# EAGLE design hardware (EAGLE 7.1.0)
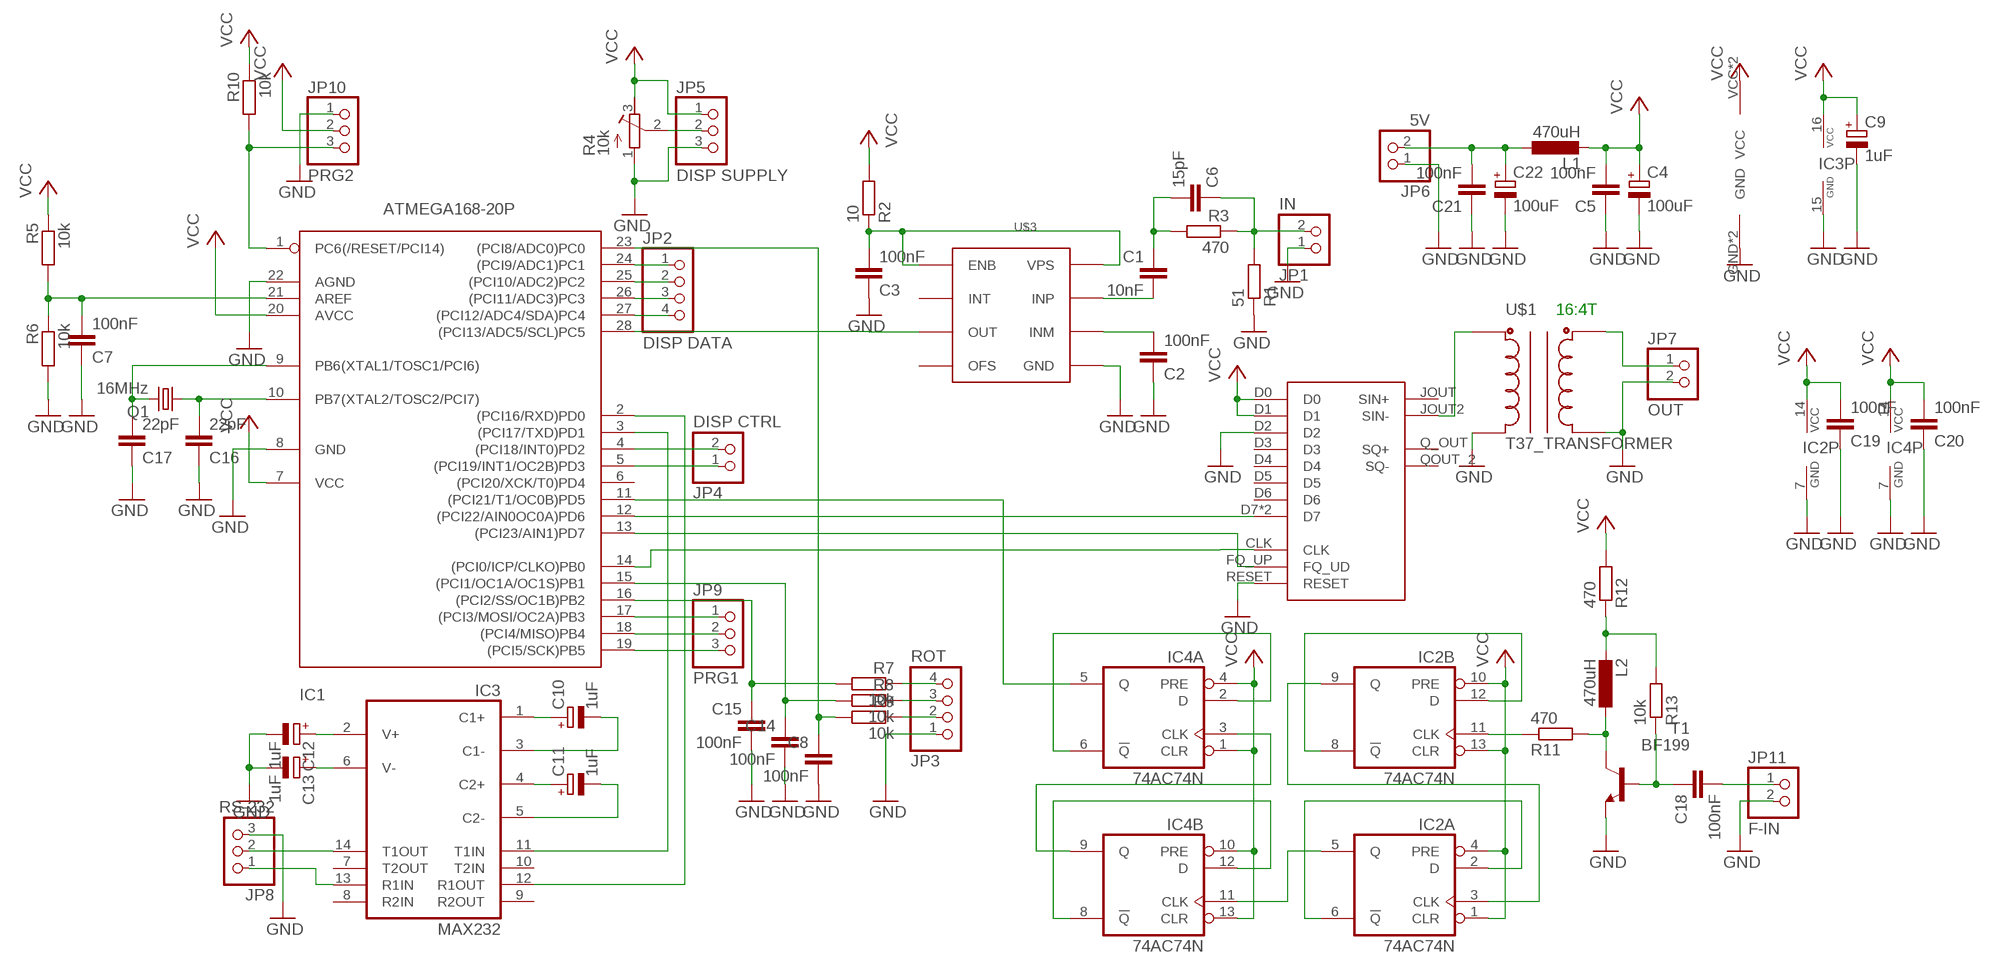
[diagram p0: schematic, sheet 1]

## Parts
C1  10nF  C-EU025-025X050  [C025-025X050]
C2  100nF  C-EU025-025X050  [C025-025X050]
C3  100nF  C-EU025-025X050  [C025-025X050]
C4  100uF  CPOL-EUE2.5-6  [E2,5-6]
C5  100nF  C-EU025-025X050  [C025-025X050]
C6  15pF  C-EU025-025X050  [C025-025X050]
C7  100nF  C-EU025-025X050  [C025-025X050]
C8  100nF  C-EU025-025X050  [C025-025X050]
C9  1uF  CPOL-EUE2.5-6  [E2,5-6]
C10  1uF  CPOL-EUE5-5  [E5-5]
C11  1uF  CPOL-EUE2.5-5  [E2,5-5]
C12  1uF  CPOL-EUE2.5-6  [E2,5-6]
C13  1uF  CPOL-EUE2.5-6  [E2,5-6]
C14  100nF  C-EU050-025X075  [C050-025X075]
C15  100nF  C-EU050-025X075  [C050-025X075]
C16  22pF  C-EU050-025X075  [C050-025X075]
C17  22pF  C-EU050-025X075  [C050-025X075]
C18  100nF  C-EU075-032X103  [C075-032X103]
C19  100nF  C-EU025-025X050  [C025-025X050]
C20  100nF  C-EU025-025X050  [C025-025X050]
C21  100nF  C-EU025-025X050  [C025-025X050]
C22  100uF  CPOL-EUE2.5-6  [E2,5-6]
IC1  ATMEGA168-20P  [DIL28-3]
IC2  74AC74N  [DIL14]
IC3  MAX232  [DIL16]
IC4  74AC74N  [DIL14]
JP1  IN  PINHD-1X2  [1X02]
JP2  DISP DATA  PINHD-1X4  [1X04]
JP3  ROT  PINHD-1X4  [1X04]
JP4  DISP CTRL  PINHD-1X2  [1X02]
JP5  DISP SUPPLY  PINHD-1X3  [1X03]
JP6  5V  PINHD-1X2  [1X02]
JP7  OUT  PINHD-1X2  [1X02]
JP8  RS-232  PINHD-1X3  [1X03]
JP9  PRG1  PINHD-1X3  [1X03]
JP10  PRG2  PINHD-1X3  [1X03]
JP11  F-IN  PINHD-1X2  [1X02]
L1  470uH  L-EU0204/7  [0204/7]
L2  470uH  L-EU0204/7  [0204/7]
Q1  16MHz  CRYSTALHC49S  [HC49/S]
R1  51  R-EU_0204/2V  [0204V]
R2  10  R-EU_0207/10  [0207/10]
R3  470  R-EU_0204/2V  [0204V]
R4  10k  R-TRIMM3339P  [RTRIM3339P]
R5  10k  R-EU_0204/2V  [0204V]
R6  10k  R-EU_0204/2V  [0204V]
R7  10k  R-EU_0204/5  [0204/5]
R8  10k  R-EU_0204/2V  [0204V]
R9  10k  R-EU_0207/10  [0207/10]
R10  10k  R-EU_0207/15  [0207/15]
R11  470  R-EU_0207/10  [0207/10]
R12  470  R-EU_0204/7  [0204/7]
R13  10k  R-EU_0204/2V  [0204V]
T1  BF199  BF494-NPN-TO92-CEB  [TO92-CEB]
U$1  T37_TRANSFORMER  [T37_TRANSFORMER]
U$2  DDS-1  [DDS-1]
U$3  AD8307  [DIL08]

## Nets
GND: C2.1 C3.1 C4.- C5.1 C7.1 C8.2 C9.- C12.- C13.- C14.2 C15.2 C16.1 C17.1 C19.1 C20.1 C21.1 C22.- IC1.8(GND) IC1.22(AGND) IC2.7(P:GND) IC3.15(GND) IC4.7(P:GND) JP1.1 JP3.1 JP5.3 JP6.1 JP7.2 JP8.3 JP10.1 JP11.2 R1.1 R4.1(A) R6.2 T1.E U$1.C1A U$1.C2A U$2.D2 U$2.GND U$2.GND2(GND) U$2.RESET U$3.2(GND)
N$1: IC1.17((PCI3/MOSI/OC2A)PB3) JP9.1
N$2: C6.1 JP1.2 R1.2 R3.1
N$3: C1.2 U$3.8(INP)
N$4: C2.2 U$3.1(INM)
N$5: IC1.18((PCI4/MISO)PB4) JP9.2
N$6: IC1.19((PCI5/SCK)PB5) JP9.3
N$7: IC1.1(PC6(/RESET/PCI14)) JP10.3 R10.2
N$8: C3.2 R2.1 U$3.6(ENB) U$3.7(VPS)
N$9: IC1.28((PCI13/ADC5/SCL)PC5) U$3.4(OUT)
N$10: C21.2 C22.+ JP6.2 L1.1
N$11: IC3.14(T1OUT) JP8.2
N$12: C1.1 C6.2 R3.2
N$13: U$1.C1B U$2.JOUT2(SIN-)
N$14: JP7.1 U$1.C2B
N$15: IC1.13((PCI23/AIN1)PD7) U$2.FQ_UP(FQ_UD)
N$16: IC1.27((PCI12/ADC4/SDA)PC4) JP2.4
N$17: IC1.3((PCI17/TXD)PD1) IC3.11(T1IN)
N$18: IC1.26((PCI11/ADC3)PC3) JP2.3
N$19: IC1.25((PCI10/ADC2)PC2) JP2.2
N$20: IC1.24((PCI9/ADC1)PC1) JP2.1
N$21: C15.1 IC1.16((PCI2/SS/OC1B)PB2) R7.2
N$22: IC1.2((PCI16/RXD)PD0) IC3.12(R1OUT)
N$23: C14.1 IC1.15((PCI1/OC1A/OC1S)PB1) R8.2
N$24: JP3.4 R7.1
N$25: IC1.4((PCI18/INT0)PD2) JP4.2
N$26: IC1.14((PCI0/ICP/CLKO)PB0) U$2.CLK
N$27: IC1.5((PCI19/INT1/OC2B)PD3) JP4.1
N$28: JP5.2 R4.2(S)
N$29: C7.2 IC1.21(AREF) R5.2 R6.1
N$30: IC1.12((PCI22/AIN0OC0A)PD6) U$2.D7 U$2.D7_2(D7)
N$31: JP3.3 R8.1
N$32: JP3.2 R9.1
N$33: C8.1 IC1.23((PCI8/ADC0)PC0) R9.2
N$34: IC3.13(R1IN) JP8.1
N$35: C12.+ IC3.2(V+)
N$36: C13.+ IC3.6(V-)
N$37: C16.2 IC1.10(PB7(XTAL2/TOSC2/PCI7)) Q1.1
N$38: C10.+ IC3.1(C1+)
N$39: C10.- IC3.3(C1-)
N$40: C11.+ IC3.4(C2+)
N$41: C11.- IC3.5(C2-)
N$42: C17.2 IC1.9(PB6(XTAL1/TOSC1/PCI6)) Q1.2
N$45: IC4.2(A:D) IC4.6(A:!Q)
N$46: IC1.11((PCI21/T1/OC0B)PD5) IC4.5(A:Q)
N$47: IC2.8(B:!Q) IC2.12(B:D)
N$48: IC2.2(A:D) IC2.6(A:!Q)
N$49: IC4.8(B:!Q) IC4.12(B:D)
N$50: IC2.3(A:CLK) IC2.9(B:Q)
N$51: IC2.5(A:Q) IC4.11(B:CLK)
N$52: IC4.3(A:CLK) IC4.9(B:Q)
N$53: IC2.11(B:CLK) R11.1
N$54: L2.1 R11.2 T1.C
N$55: L2.2 R12.1 R13.2
N$56: C18.1 R13.1 T1.B
N$57: C18.2 JP11.1
VCC: C4.+ C5.2 C9.+ C19.2 C20.2 IC1.7(VCC) IC1.20(AVCC) IC2.1(A:CLR) IC2.4(A:PRE) IC2.10(B:PRE) IC2.13(B:CLR) IC2.14(P:VCC) IC3.16(VCC) IC4.1(A:CLR) IC4.4(A:PRE) IC4.10(B:PRE) IC4.13(B:CLR) IC4.14(P:VCC) JP5.1 JP10.2 L1.2 R2.2 R4.3(E) R5.1 R10.1 R12.2 U$2.D0 U$2.D1 U$2.VCC U$2.VCC2(VCC)
Unconnected: IC1.6((PCI20/XCK/T0)PD4) IC3.7(T2OUT) IC3.8(R2IN) IC3.9(R2OUT) IC3.10(T2IN) U$2.D3 U$2.D4 U$2.D5 U$2.D6 U$2.JOUT(SIN+) U$2.Q_OUT(SQ+) U$2.QOUT_2(SQ-) U$3.3(OFS) U$3.5(INT)

## Notes on the sheet
- 16:4T

## Library data of the parts
C1-C3 C5-C8 C14-C21 = rcl:C-EU: CAPACITOR, European symbol
C4 C9-C13 C22 = rcl:CPOL-EU: POLARIZED CAPACITOR, European symbol
IC1 = adafruit:ATMEGA168*P: MICROCONTROLLER 16 kBytes FLASH 1 kBytes SRAM 512 Bytes EEPROM USART 8-channel 10 bit ADC
IC2 IC4 = 74xx-eu:74*74: Dual D type positive edge triggered FLIP FLOP, preset and clear
IC3 = maxim:MAX232: RS232 TRANSCEIVER; MF: MAXIM; MPN: MAX232ACPE+; OC_FARNELL: 9723773; OC_NEWARK: 68K4544
JP1 JP4 JP6 JP7 JP11 = pinhead:PINHD-1X2: PIN HEADER
JP2 JP3 = pinhead:PINHD-1X4: PIN HEADER
JP5 JP8-JP10 = pinhead:PINHD-1X3: PIN HEADER
L1 L2 = rcl:L-EU: INDUCTOR, European symbol
Q1 = crystal:CRYSTAL: CRYSTAL; OC_FARNELL: 1667008; OC_NEWARK: unknown
R1-R3 R5-R13 = rcl:R-EU_: RESISTOR, European symbol
R4 = rcl:R-TRIMM: Trimm resistor
T1 = transistor-neu-to92:*-NPN-: NPN Transistror
U$1 = toroid:T37_TRANSFORMER: Transformer wound on a T37 Toroid
U$2 = minikits:DDS-1
U$3 = -- Eigene:AD8307

## Board
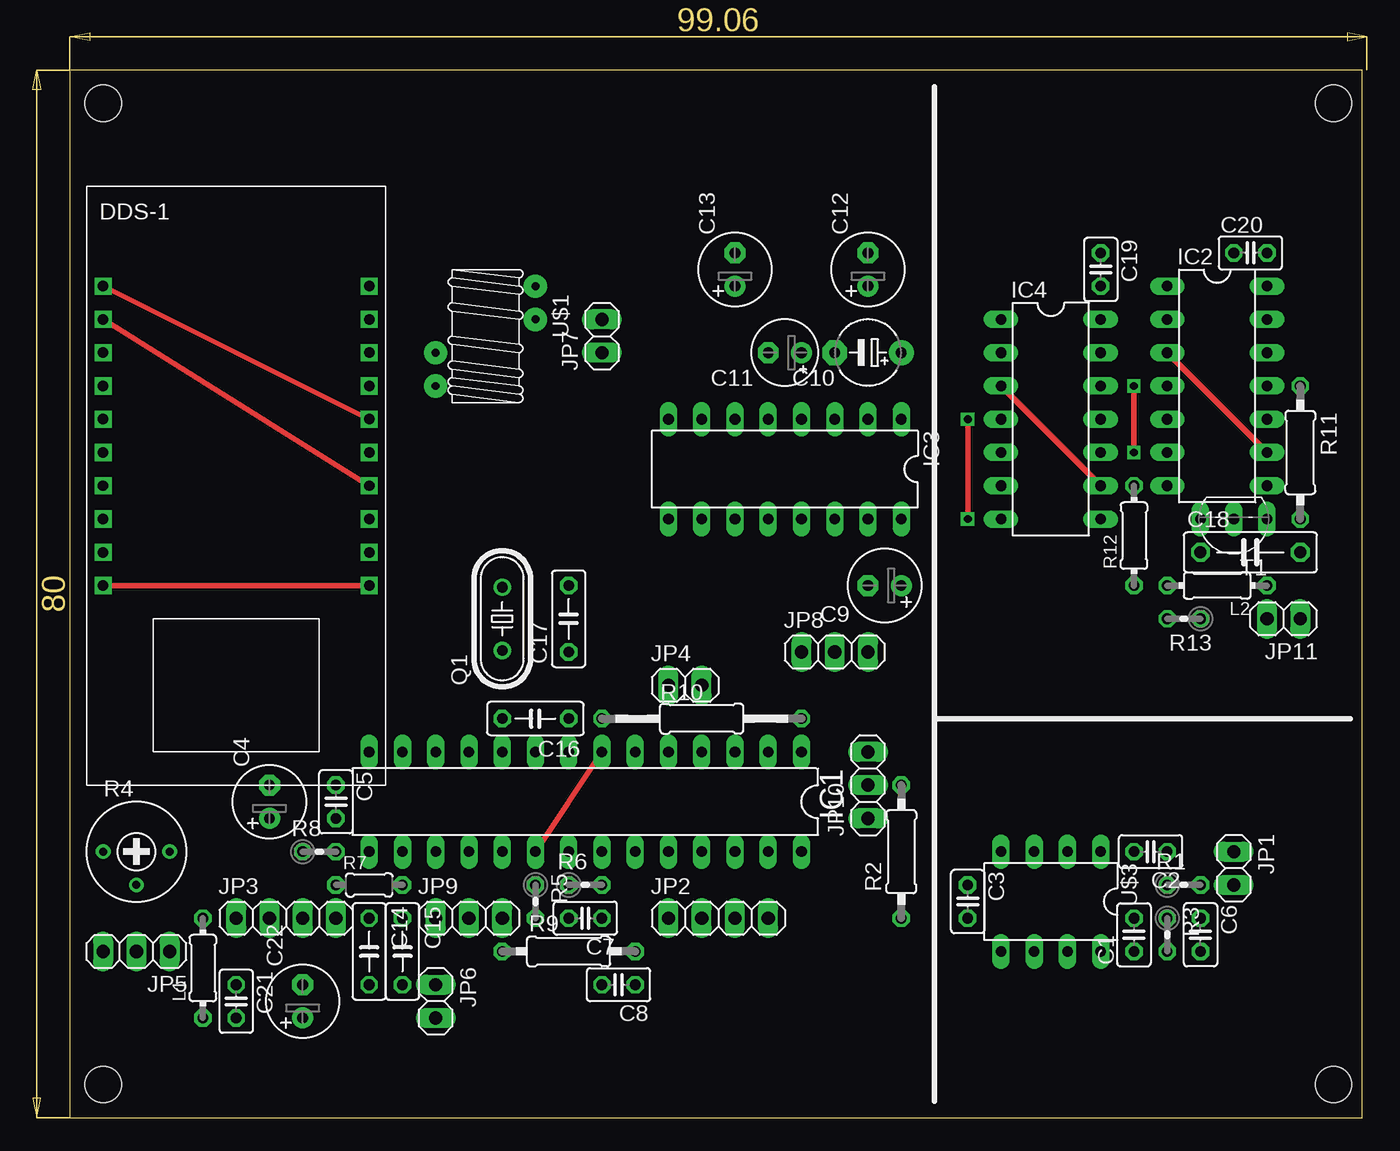
[diagram p1: board, top side]
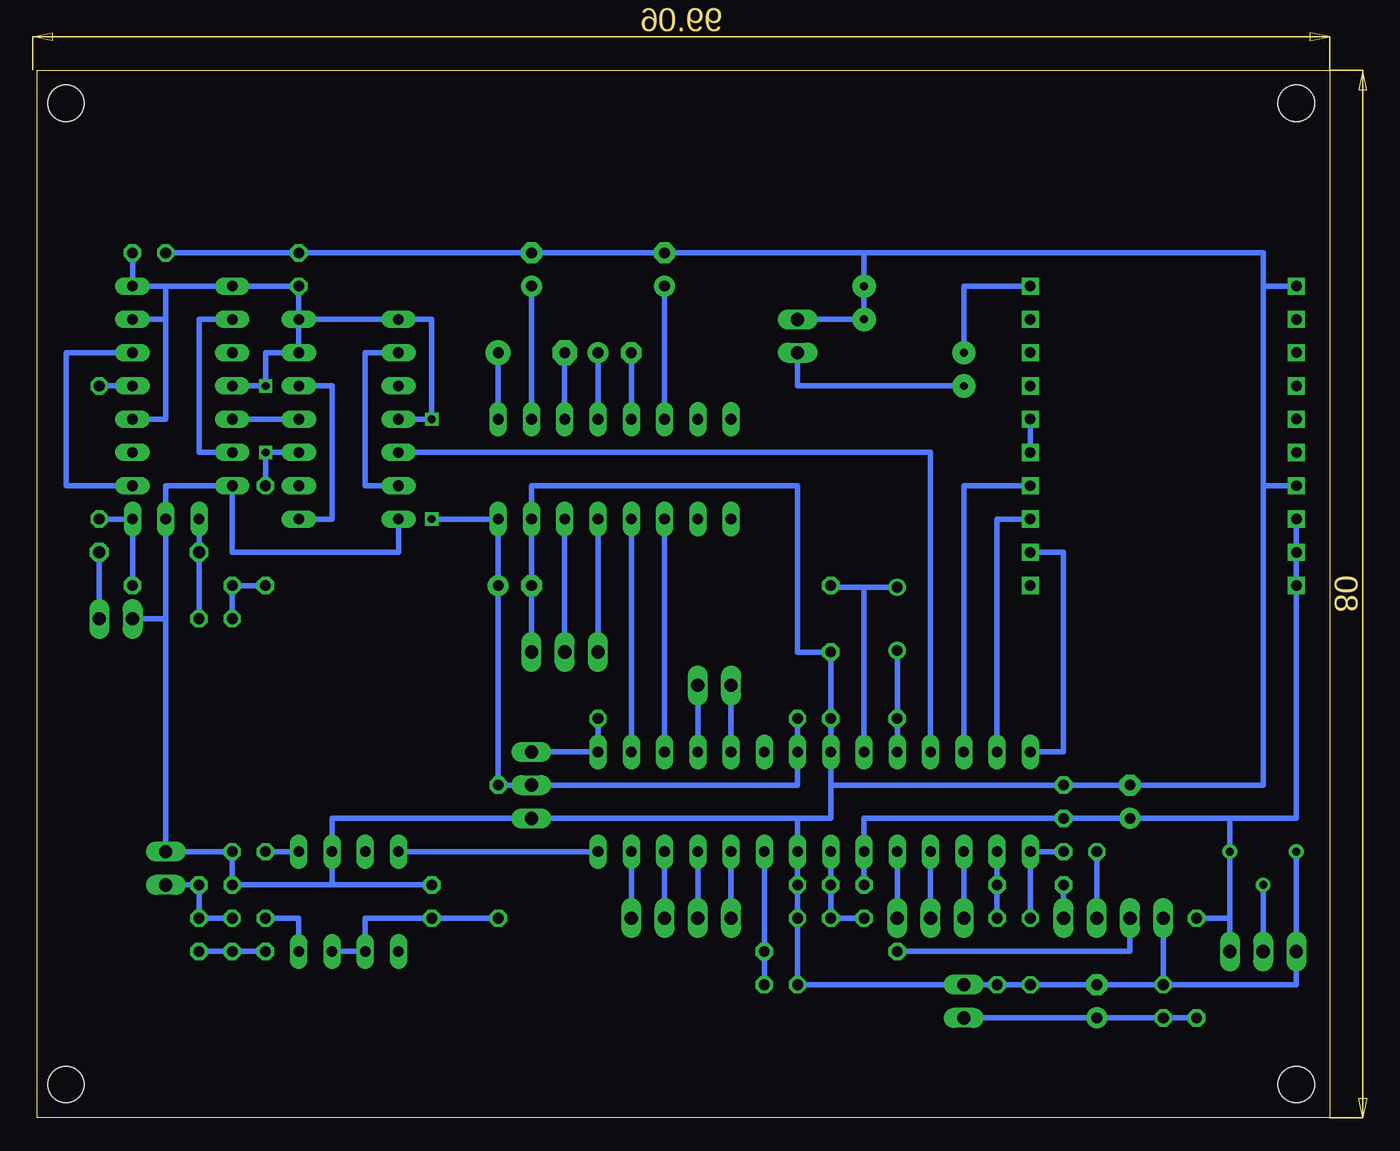
[diagram p2: board, bottom side, seen from below]

Size 98.73 x 80 mm. Coordinates in mm from the lower left corner, seen from the top.
Outline: 0,0 98.73,0 98.73,80 0,80 0,0
Copper layers (1*16): Top 0.035mm / dielectric 1.5mm / Bottom 0.035mm
Design rules "default": minimum track width 10mil, minimum drill 24mil, track to track 8mil, track to pad 8mil, pad to pad 8mil, via to via 8mil, smd to smd 8mil, copper to edge 40mil, drill to drill 8mil, minimum pad ring 10mil, minimum via ring 8mil, stop-mask expansion 4mil, vias tented up to drill 0mil, thermal gap 10mil
Holes 2.8 mm at 2.54,77.47 2.54,2.54 96.52,2.54 96.52,77.47

### Footprints (pad centres in the part's own frame; a part is rotated, then mirrored left to right if it is on the bottom)
C025-025X050 = drill 0.813 octagon: 1 -1.27,0; 2 1.27,0
E2,5-6 = drill 0.813 pad 1.6: + -1.27,0 | drill 0.813 pad 1.6 octagon: - 1.27,0
E5-5 = drill 0.813 pad 1.905: + -2.54,0 | drill 0.813 pad 1.905 octagon: - 2.54,0
E2,5-5 = drill 0.813 pad 1.6: + -1.27,0 | drill 0.813 pad 1.6 octagon: - 1.27,0
C050-025X075 = drill 0.813 octagon: 1 -2.54,0; 2 2.54,0
C075-032X103 = drill 0.914 octagon: 1 -3.81,0; 2 3.81,0
DIL28-3 = drill 0.813 long: 1 -16.51,-3.81; 2 -13.97,-3.81; 3 -11.43,-3.81; 4 -8.89,-3.81; 5 -6.35,-3.81; 6 -3.81,-3.81; 7 -1.27,-3.81; 8 1.27,-3.81; 9 3.81,-3.81; 10 6.35,-3.81; 11 8.89,-3.81; 12 11.43,-3.81; 13 13.97,-3.81; 14 16.51,-3.81; 15 16.51,3.81; 16 13.97,3.81; 17 11.43,3.81; 18 8.89,3.81; 19 6.35,3.81; 20 3.81,3.81; 21 1.27,3.81; 22 -1.27,3.81; 23 -3.81,3.81; 24 -6.35,3.81; 25 -8.89,3.81; 26 -11.43,3.81; 27 -13.97,3.81; 28 -16.51,3.81
DIL14 = drill 0.813 long: 1 -7.62,-3.81; 2 -5.08,-3.81; 3 -2.54,-3.81; 4 0,-3.81; 5 2.54,-3.81; 6 5.08,-3.81; 7 7.62,-3.81; 8 7.62,3.81; 9 5.08,3.81; 10 2.54,3.81; 11 0,3.81; 12 -2.54,3.81; 13 -5.08,3.81; 14 -7.62,3.81
DIL16 = drill 0.813 long: 1 -8.89,-3.81; 2 -6.35,-3.81; 3 -3.81,-3.81; 4 -1.27,-3.81; 5 1.27,-3.81; 6 3.81,-3.81; 7 6.35,-3.81; 8 8.89,-3.81; 9 8.89,3.81; 10 6.35,3.81; 11 3.81,3.81; 12 1.27,3.81; 13 -1.27,3.81; 14 -3.81,3.81; 15 -6.35,3.81; 16 -8.89,3.81
1X02 = drill 1.016 long: 1 -1.27,0; 2 1.27,0
1X04 = drill 1.016 long: 1 -3.81,0; 2 -1.27,0; 3 1.27,0; 4 3.81,0
1X03 = drill 1.016 long: 1 -2.54,0; 2 0,0; 3 2.54,0
0204/7 = drill 0.813 octagon: 1 -3.81,0; 2 3.81,0
HC49/S = drill 0.813: 1 -2.413,0; 2 2.413,0
0204V = drill 0.813 octagon: 1 -1.27,0; 2 1.27,0
0207/10 = drill 0.813 octagon: 1 -5.08,0; 2 5.08,0
RTRIM3339P = drill 0.61: 1 -2.54,0; 2 0,-2.54; 3 2.54,0
0204/5 = drill 0.813 octagon: 1 -2.54,0; 2 2.54,0
0207/15 = drill 0.813 octagon: 1 -7.62,0; 2 7.62,0
TO92-CEB = drill 0.813 long: B 2.54,0; C -2.54,0; E 0,0
T37_TRANSFORMER = drill 0.6 pad 1.778: C1A -3.81,-3.81; C1B 3.81,1.27; C2A -3.81,-1.27; C2B 3.81,3.81
DDS-1 = drill 0.8 square: CLK -11.43,7.62; D0 8.89,7.62; D1 8.89,5.08; D2 8.89,2.54; D3 8.89,0; D4 8.89,-2.54; D5 8.89,-5.08; D6 8.89,-7.62; D7 -11.43,2.54; D7_2 8.89,-10.16; FQ_UP -11.43,5.08; GND -11.43,-2.54; GND2 8.89,-12.7; JOUT -11.43,-10.16; JOUT2 -11.43,-12.7; Q_OUT -11.43,-5.08; QOUT_2 -11.43,-7.62; RESET -11.43,0; VCC -11.43,10.16; VCC2 8.89,10.16
DIL08 = drill 0.813 long: 1 -3.81,-3.81; 2 -1.27,-3.81; 3 1.27,-3.81; 4 3.81,-3.81; 5 3.81,3.81; 6 1.27,3.81; 7 -1.27,3.81; 8 -3.81,3.81

### Placement (x,y rotation side)
C1  81.28,13.97 90 top
C2  82.55,20.32 180 top
C3  68.58,16.51 270 top
C4  15.24,24.13 90 top
C5  20.32,24.13 270 top
C6  86.36,13.97 270 top
C7  39.37,15.24 180 top
C8  41.91,10.16 180 top
C9  62.23,40.64 180 top
C10  60.96,58.42 180 top
C11  54.61,58.42 180 top
C12  60.96,64.77 90 top
C13  50.8,64.77 90 top
C14  22.86,12.7 270 top
C15  25.4,12.7 270 top
C16  35.56,30.48 180 top
C17  38.1,38.1 90 top
C18  90.17,43.18 0 top
C19  78.74,64.77 270 top
C20  90.17,66.04 0 top
C21  12.7,8.89 270 top
C22  17.78,8.89 90 top
IC1  39.37,24.13 180 top
IC2  87.63,55.88 270 top
IC3  54.61,49.53 180 top
IC4  74.93,53.34 270 top
JP1  88.9,19.05 270 top
JP2  49.53,15.24 0 top
JP3  16.51,15.24 0 top
JP4  46.99,33.02 0 top
JP5  5.08,12.7 180 top
JP6  27.94,8.89 270 top
JP7  40.64,59.69 90 top
JP8  58.42,35.56 0 top
JP9  30.48,15.24 0 top
JP10  60.96,25.4 90 top
JP11  92.71,38.1 180 top
L1  10.16,11.43 90 top
L2  87.63,40.64 180 top
Q1  33.02,38.1 90 top
R1  85.09,17.78 0 top
R2  63.5,20.32 90 top
R3  83.82,13.97 270 top
R4  5.08,20.32 0 top
R5  35.56,16.51 270 top
R6  39.37,17.78 0 top
R7  22.86,17.78 0 top
R8  19.05,20.32 0 top
R9  38.1,12.7 0 top
R10  48.26,30.48 0 top
R11  93.98,50.8 270 top
R12  81.28,44.45 90 top
R13  85.09,38.1 180 top
T1  88.9,45.72 180 top
U$1  31.75,59.69 180 top
U$2  11.43,50.8 180 top
U$3  74.93,16.51 180 top

### Tracks (layer width: path | path; a pad name or v marks a point on that pad's centre or on a via)
GND
  Top 0.406: U$2.GND2 U$2.GND
  Bottom 0.406: C3.1 76.2,17.78 | 76.2,17.78 U$3.2 | U$2.RESET U$2.GND | 38.1,25.4 IC1.8 C16.1 38.1,31.75 C17.1 40.64,35.56 40.64,48.26 60.96,48.26 IC3.15 C9.- JP8.3 | 38.1,25.4 38.1,22.86 40.64,22.86 | U$3.2 76.2,17.78 | C13.- C12.- | 76.2,17.78 R1.1 C2.1 JP1.1 88.9,38.1 | 40.64,22.86 IC1.22 R6.2 C7.1 C8.2 JP6.1 | U$3.2 76.2,22.86 71.12,22.86 JP10.1 | U$2.GND2 5.08,63.5 | 5.08,63.5 5.08,48.26 U$2.D2 | 5.08,66.04 33.02,66.04 | 33.02,66.04 C13.- | JP7.2 U$1.C2A U$1.C1A 35.56,66.04 33.02,66.04 | 38.1,25.4 C5.1 C4.- 5.08,25.4 5.08,63.5 | R4.1 JP5.3 2.54,10.16 | C14.2 C15.2 | JP10.1 40.64,22.86 | C15.2 C14.2 | JP10.1 66.04,22.86 | C12.- C13.- | C13.- 33.02,66.04 | 33.02,66.04 5.08,66.04 | 88.9,38.1 T1.E 88.9,48.26 IC2.7 83.82,43.18 71.12,43.18 IC4.7 | JP11.2 88.9,38.1 | 5.08,66.04 5.08,63.5 | C12.- 63.5,66.04 C19.1 C20.1 | R4.1 2.54,10.16 | C15.2 JP6.1 | C15.2 C14.2 | C21.1 C22.- C14.2 | R4.1 2.54,10.16 | JP3.1 C21.1 | 2.54,10.16 C21.1 | JP6.1 C15.2
N$1
  Bottom 0.406: JP9.1 IC1.17
N$2
  Bottom 0.406: R3.1 C6.1 R1.2 JP1.2
N$3
  Bottom 0.406: U$3.8 78.74,15.24 C1.2
N$4
  Bottom 0.406: C2.2 U$3.1
N$5
  Bottom 0.406: JP9.2 IC1.18
N$6
  Bottom 0.406: JP9.3 IC1.19
N$7
  Bottom 0.406: R10.2 IC1.1 JP10.3
N$8
  Bottom 0.406: U$3.7 U$3.6 73.66,15.24 71.12,15.24 | C3.2 71.12,15.24 | C3.2 71.12,15.24 | R2.1 C3.2
N$9
  Bottom 0.406: U$3.4 IC1.28
N$10
  Bottom 0.406: C22.+ 19.05,7.62 | 19.05,7.62 JP6.2 | L1.1 C21.2 19.05,7.62
N$11
  Bottom 0.406: JP8.2 IC3.14
N$12
  Bottom 0.406: C6.2 R3.2 C1.1
N$13
  Bottom 0.406: U$2.JOUT2 27.94,63.5 U$1.C1B
N$14
  Bottom 0.406: U$1.C2B 40.64,55.88 JP7.1
N$15
  Bottom 0.406: U$2.FQ_UP 25.4,45.72 IC1.13
N$16
  Bottom 0.406: JP2.4 IC1.27
N$17
  Bottom 0.406: IC1.3 IC3.11
N$18
  Bottom 0.406: JP2.3 IC1.26
N$19
  Bottom 0.406: JP2.2 IC1.25
N$20
  Bottom 0.406: JP2.1 IC1.24
N$21
  Bottom 0.406: C15.1 R7.2 IC1.16
N$22
  Bottom 0.406: IC1.2 IC3.12
N$23
  Bottom 0.406: R8.2 IC1.15 C14.1
N$24
  Bottom 0.406: JP3.4 R7.1
N$25
  Bottom 0.406: IC1.4 JP4.2
N$26
  Bottom 0.406: U$2.CLK 20.32,43.18 20.32,27.94 IC1.14
N$27
  Bottom 0.406: IC1.5 JP4.1
N$28
  Bottom 0.406: JP5.2 R4.2
N$29
  Bottom 0.406: IC1.21 R6.1 C7.2 R5.2
N$30
  Top 0.406: U$2.D7 U$2.D7_2
  Bottom 0.406: U$2.D7 27.94,48.26 IC1.12
N$31
  Bottom 0.406: JP3.3 R8.1
N$32
  Bottom 0.406: R9.1 15.24,12.7 JP3.2
N$33
  Bottom 0.406: R9.2 C8.1 IC1.23
N$34
  Bottom 0.406: JP8.1 IC3.13
N$35
  Bottom 0.406: C12.+ IC3.2
N$36
  Bottom 0.406: C13.+ IC3.6
N$37
  Bottom 0.406: IC1.10 C16.2 Q1.1
N$38
  Bottom 0.406: C10.+ IC3.1
N$39
  Bottom 0.406: C10.- IC3.3
N$40
  Bottom 0.406: C11.+ IC3.4
N$41
  Bottom 0.406: C11.- IC3.5
N$42
  Bottom 0.406: IC1.9 35.56,40.51 Q1.2 38.1,40.51 C17.2
N$45
  Bottom 0.406: IC4.6 73.66,48.26 73.66,58.42 IC4.2
N$46
  Bottom 0.406: IC4.5 30.48,50.8 IC1.11
N$47
  Bottom 0.406: IC2.8 96.52,48.26 96.52,58.42 IC2.12
N$48
  Bottom 0.406: IC2.6 86.36,50.8 86.36,60.96 IC2.2
N$49
  Bottom 0.406: IC4.8 76.2,45.72 76.2,55.88 IC4.12
N$50
  Top 0.406: IC2.9 IC2.3
N$51
  Bottom 0.406: IC4.11 IC2.5
N$52
  Top 0.406: IC4.3 IC4.9
N$53
  Bottom 0.406: IC2.11 R11.1
N$54
  Bottom 0.406: R11.2 T1.C L2.1
N$55
  Bottom 0.406: R13.2 L2.2 R12.1
N$56
  Bottom 0.406: R13.1 C18.1 T1.B
N$57
  Bottom 0.406: JP11.1 C18.2
VCC  (via drill 0.6)
  Top 0.406: U$2.VCC2 U$2.VCC | IC1.20 IC1.7 | v81.28,50.8 v81.28,55.88 | v68.58,45.72 v68.58,53.34
  Bottom 0.406: U$2.D1 U$2.D0 U$2.VCC2 2.54,22.86 7.62,22.86 | IC1.7 40.64,25.4 | R5.1 IC1.20 35.56,22.86 C5.2 | IC1.7 40.64,25.4 | 40.64,25.4 59.69,25.4 JP10.2 | JP10.2 62.23,25.4 | 62.23,25.4 R2.2 C9.+ IC3.16 v68.58,45.72 | IC1.7 R10.1 | C5.2 C4.+ | 7.62,22.86 R4.3 | R4.3 7.62,15.24 | 7.62,15.24 JP5.1 | C5.2 C4.+ | JP10.2 62.23,25.4 | R4.3 7.62,22.86 | IC2.10 88.9,53.34 88.9,60.96 | 88.9,60.96 IC2.13 | 88.9,60.96 88.9,63.5 | 88.9,63.5 IC2.14 C20.2 | 88.9,63.5 IC2.1 C19.2 | IC4.10 v81.28,50.8 R12.2 | IC2.4 v81.28,55.88 81.28,58.42 IC4.13 IC4.14 | IC4.14 IC4.1 68.58,60.96 v68.58,53.34 | C19.2 78.74,62.23 | 78.74,62.23 IC4.14 | v68.58,53.34 IC4.4 v68.58,53.34 | C19.2 78.74,62.23 | 78.74,62.23 C19.2 | 7.62,22.86 C4.+ | L1.2 7.62,15.24